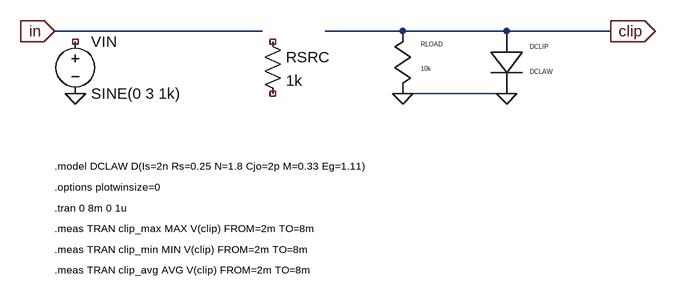
[diagram p0: schematic diode_clipper_spectrum.asc]
diode_clipper_spectrum.asc, the LTspice schematic file:
Version 4
SHEET 1 1200 871
WIRE 64 288 384 288
WIRE 480 288 920 288
WIRE 600 384 760 384
SYMBOL voltage 96 288 R0
SYMATTR InstName VIN
SYMATTR Value SINE(0 3 1k)
SYMBOL res 384 288 R0
SYMATTR InstName RSRC
SYMATTR Value 1k
SYMBOL res_v 600 288 R0
SYMATTR InstName RLOAD
SYMATTR Value 10k
SYMBOL diode_v 760 288 R0
SYMATTR InstName DCLIP
SYMATTR Value DCLAW
FLAG 64 288 in
IOPIN 64 288 In
FLAG 920 288 clip
IOPIN 920 288 Out
FLAG 96 384 0
FLAG 600 384 0
FLAG 760 384 0
TEXT 64 496 Left 1 !.model DCLAW D(Is=2n Rs=0.25 N=1.8 Cjo=2p M=0.33 Eg=1.11)
TEXT 64 528 Left 1 !.options plotwinsize=0
TEXT 64 560 Left 1 !.tran 0 8m 0 1u
TEXT 64 592 Left 1 !.meas TRAN clip_max MAX V(clip) FROM=2m TO=8m
TEXT 64 624 Left 1 !.meas TRAN clip_min MIN V(clip) FROM=2m TO=8m
TEXT 64 656 Left 1 !.meas TRAN clip_avg AVG V(clip) FROM=2m TO=8m

The netlist it stands for:
* diode_clipper_spectrum.asc
VIN NC_01 0 SINE(0 3 1k)
RSRC NC_02 NC_03 1k
RLOAD clip 0 10k
DCLIP clip 0 DCLAW
.model D D
.lib standard.dio
.model DCLAW D(Is=2n Rs=0.25 N=1.8 Cjo=2p M=0.33 Eg=1.11)
.options plotwinsize=0
.tran 0 8m 0 1u
.meas TRAN clip_max MAX V(clip) FROM=2m TO=8m
.meas TRAN clip_min MIN V(clip) FROM=2m TO=8m
.meas TRAN clip_avg AVG V(clip) FROM=2m TO=8m
.backanno
.end